# Altium schematic sheet FPGA_U1_Manual.SchDoc
size A3
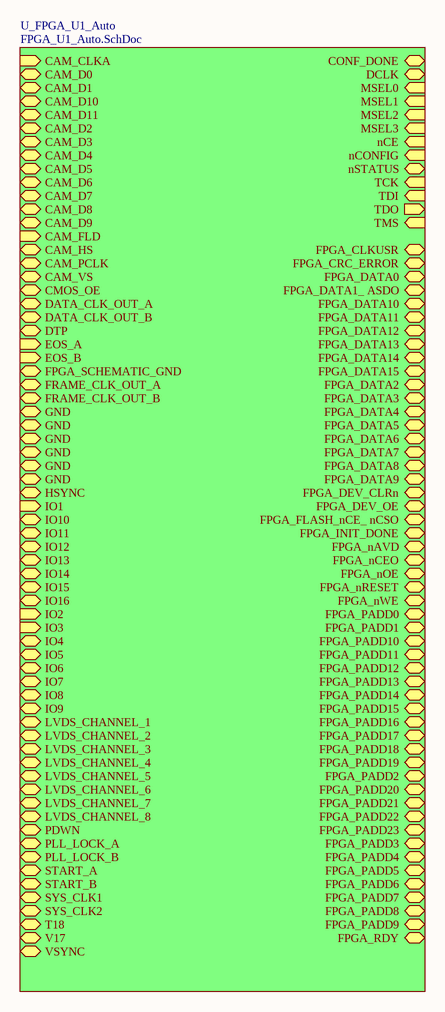
[diagram p0: FPGA_U1_Manual.SchDoc]

## Sub-sheets
U_FPGA_U1_Auto = FPGA_U1_Auto.SchDoc: CAM_CLKA (in), CAM_D0 (bidir), CAM_D1 (bidir), CAM_D10 (bidir), CAM_D11 (bidir), CAM_D2 (bidir), CAM_D3 (bidir), CAM_D4 (bidir), CAM_D5 (bidir), CAM_D6 (bidir), CAM_D7 (bidir), CAM_D8 (bidir), CAM_D9 (bidir), CAM_FLD (in), CAM_HS (bidir), CAM_PCLK (bidir), CAM_VS (bidir), CMOS_OE (bidir), DATA_CLK_OUT_A (bidir), DATA_CLK_OUT_B (bidir), DTP (bidir), EOS_A (in), EOS_B (in), FPGA_SCHEMATIC_GND (bidir), FRAME_CLK_OUT_A (bidir), FRAME_CLK_OUT_B (bidir), GND (bidir), GND (bidir), GND (bidir), GND (bidir), GND (bidir), GND (bidir), HSYNC (bidir), IO1 (in), IO10 (bidir), IO11 (bidir), IO12 (bidir), IO13 (bidir), IO14 (bidir), IO15 (bidir), IO16 (bidir), IO2 (in), IO3 (in), IO4 (bidir), IO5 (bidir), IO6 (bidir), IO7 (bidir), IO8 (bidir), IO9 (bidir), LVDS_CHANNEL_1 (bidir), LVDS_CHANNEL_2 (bidir), LVDS_CHANNEL_3 (bidir), LVDS_CHANNEL_4 (bidir), LVDS_CHANNEL_5 (bidir), LVDS_CHANNEL_6 (bidir), LVDS_CHANNEL_7 (bidir), LVDS_CHANNEL_8 (bidir), PDWN (bidir), PLL_LOCK_A (bidir), PLL_LOCK_B (bidir), START_A (bidir), START_B (bidir), SYS_CLK1 (bidir), SYS_CLK2 (bidir), T18 (bidir), V17 (bidir), VSYNC (bidir), CONF_DONE (bidir), DCLK (bidir), MSEL0 (in), MSEL1 (in), MSEL2 (in), MSEL3 (in), nCE (in), nCONFIG (in), nSTATUS (bidir), TCK (in), TDI (in), TDO (out), TMS (in), FPGA_CLKUSR (bidir), FPGA_CRC_ERROR (bidir), FPGA_DATA0 (bidir), FPGA_DATA1_ ASDO (bidir), FPGA_DATA10 (bidir), FPGA_DATA11 (bidir), FPGA_DATA12 (bidir), FPGA_DATA13 (bidir), FPGA_DATA14 (bidir), FPGA_DATA15 (bidir), FPGA_DATA2 (bidir), FPGA_DATA3 (bidir), FPGA_DATA4 (bidir), FPGA_DATA5 (bidir), FPGA_DATA6 (bidir), FPGA_DATA7 (bidir), FPGA_DATA8 (bidir), FPGA_DATA9 (bidir), FPGA_DEV_CLRn (bidir), FPGA_DEV_OE (bidir), FPGA_FLASH_nCE_ nCSO (bidir), FPGA_INIT_DONE (bidir), FPGA_nAVD (bidir), FPGA_nCEO (bidir), FPGA_nOE (bidir), FPGA_nRESET (bidir), FPGA_nWE (bidir), FPGA_PADD0 (bidir), FPGA_PADD1 (bidir), FPGA_PADD10 (bidir), FPGA_PADD11 (bidir), FPGA_PADD12 (bidir), FPGA_PADD13 (bidir), FPGA_PADD14 (bidir), FPGA_PADD15 (bidir), FPGA_PADD16 (bidir), FPGA_PADD17 (bidir), FPGA_PADD18 (bidir), FPGA_PADD19 (bidir), FPGA_PADD2 (bidir), FPGA_PADD20 (bidir), FPGA_PADD21 (bidir), FPGA_PADD22 (bidir), FPGA_PADD23 (bidir), FPGA_PADD3 (bidir), FPGA_PADD4 (bidir), FPGA_PADD5 (bidir), FPGA_PADD6 (bidir), FPGA_PADD7 (bidir), FPGA_PADD8 (bidir), FPGA_PADD9 (bidir), FPGA_RDY (bidir)